# EAGLE schematic lcd_1602 (EAGLE 9.6.2)
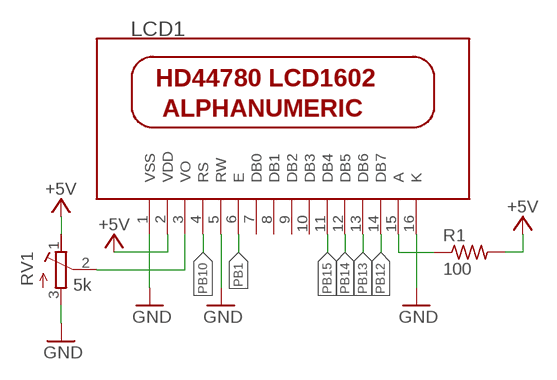
[diagram p0: schematic, sheet 1]

## Parts
LCD1  LCD-1602  [LCD-1602]
R1  100  RESISTOR_R0805  [R0805]
RV1  5k  RES-TRIM  [TRIMMER_ACOSTADO]

## Nets
+5V: LCD1.2(VDD) R1.2 RV1.1(E)
GND: LCD1.1(VSS) LCD1.5(RW) LCD1.16(K) RV1.3(A)
N$8: LCD1.15(A) R1.1
N$9: LCD1.3(VO) RV1.2(S)
PB1: LCD1.6(E)
PB10: LCD1.4(RS)
PB12: LCD1.14(DB7)
PB13: LCD1.13(DB6)
PB14: LCD1.12(DB5)
PB15: LCD1.11(DB4)
Unconnected: LCD1.7(DB0) LCD1.8(DB1) LCD1.9(DB2) LCD1.10(DB3)

## Library data of the parts
LCD1 = CaliBeta-Miselaneos:LCD-1602: LCD alfanumerico basado en el integrado HD44780, 16 columnas y 2 filas
R1 = CaliBeta-RCL:RESISTOR_: RESISTOR, simbolo Americano
RV1 = CaliBeta-RCL:RES-TRIM: Trimmer convensional pero en posicion acostada